# EasyEDA Pro project LCR表.eprj, board #第七届立创电赛#LCR数字电桥
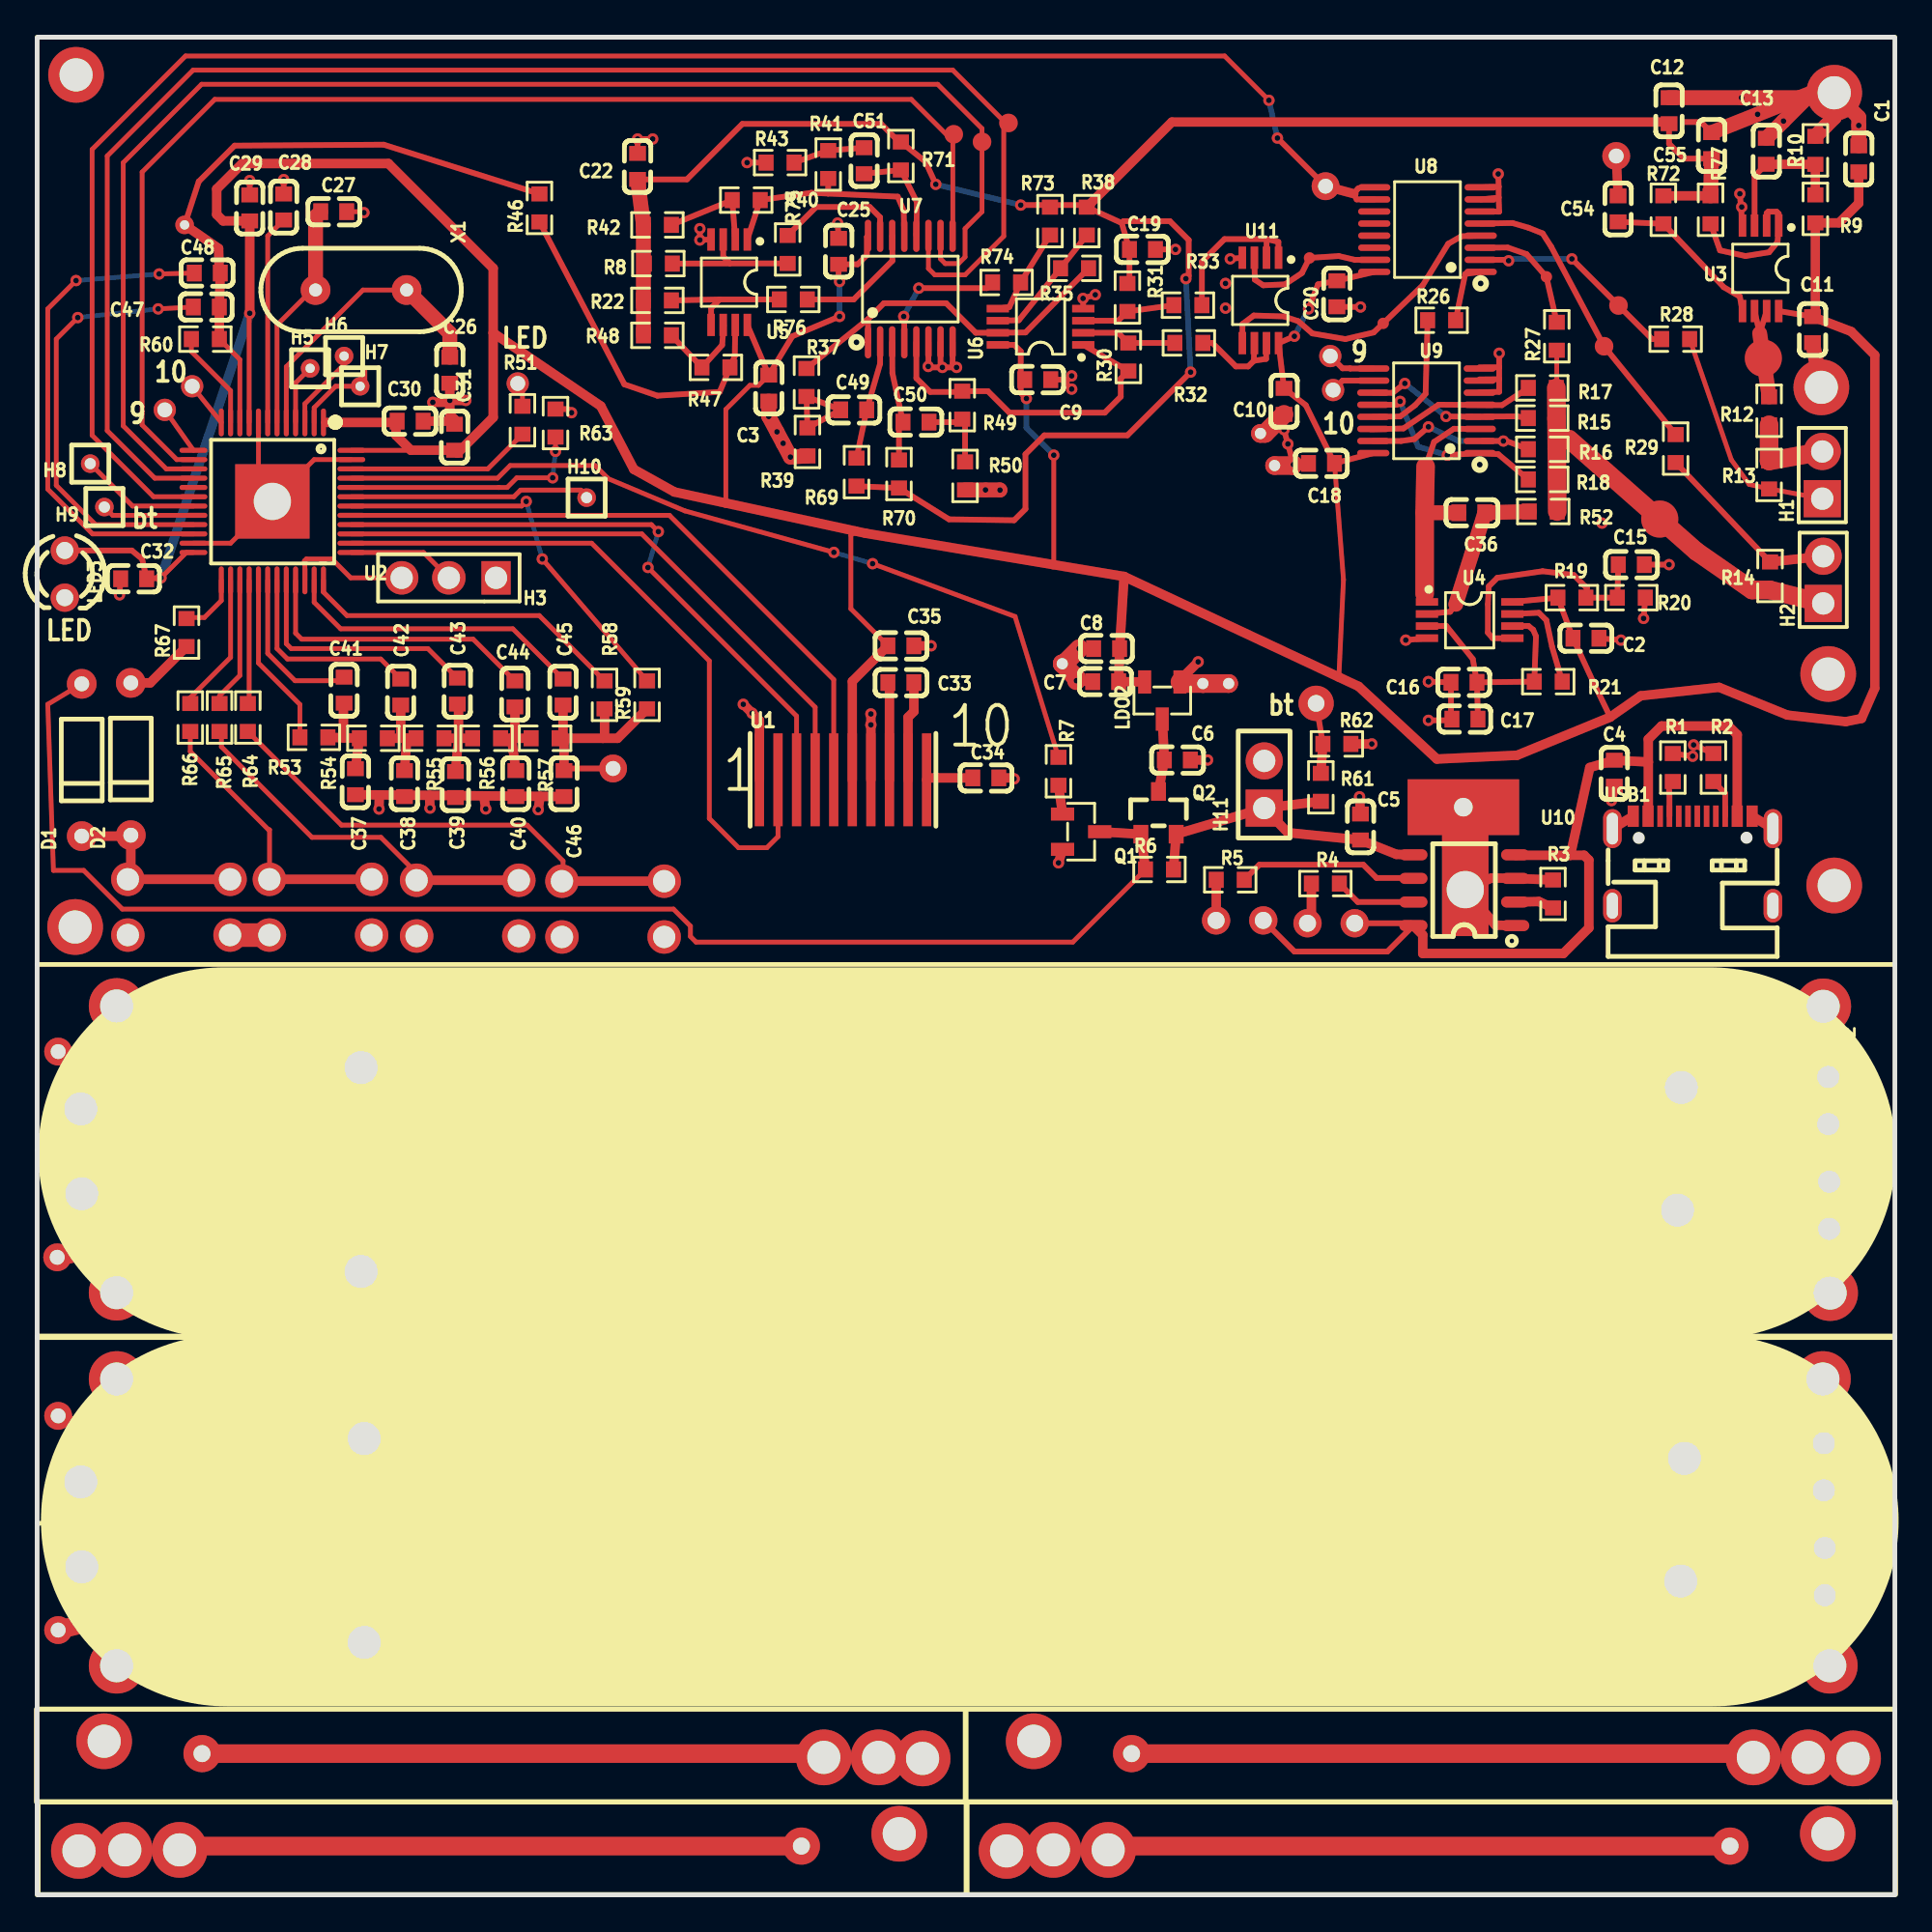
[diagram p1: board, top side]
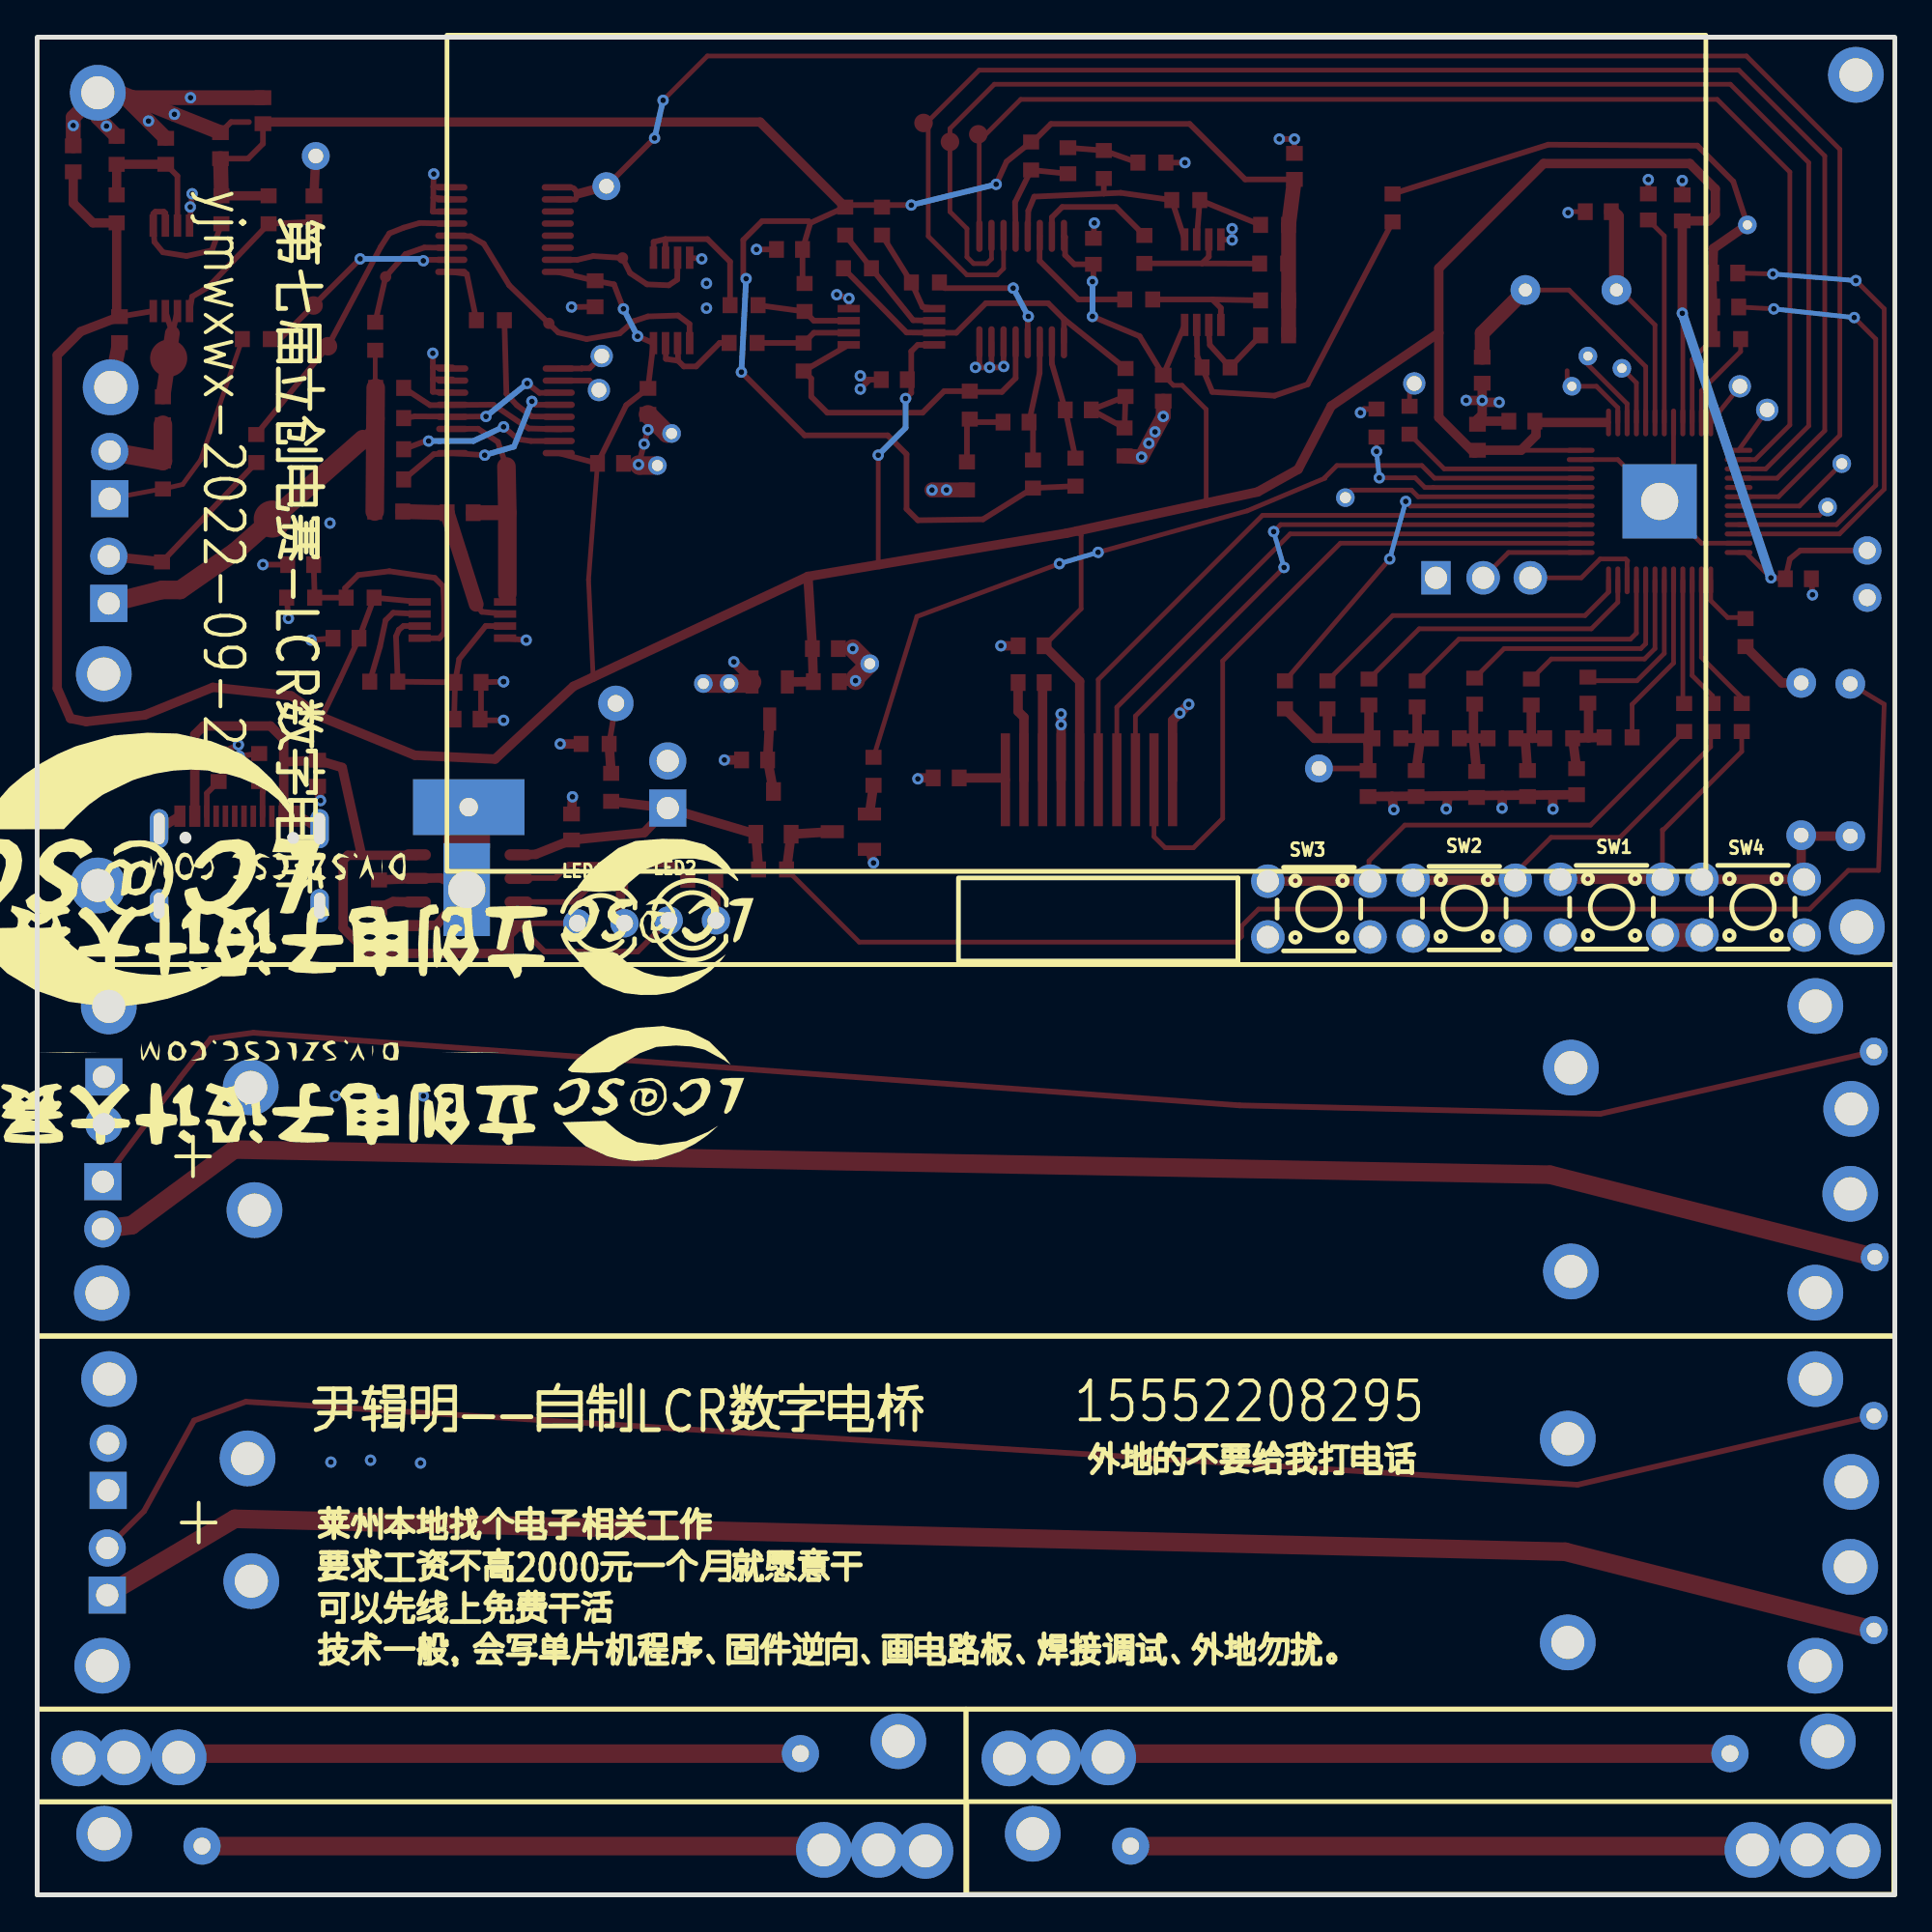
[diagram p2: board, bottom side, seen from below]

Outline 100 x 100 mm; copper layers: Top Layer, Bottom Layer. Coordinates in mm from the lower left corner of the outline.
Outline path: rectangle 0,100 100,0
Stack: Top Layer 0.035mm / Dielectric1 1.51mm FR4 er 4.5 / Bottom Layer 0.035mm

## Design rules (mm)
spacing safeClearance (default): track to track 0.152, other pairs 0.152 to 0.3
track width trackWidth (default): min 0.127, default 0.254, max 2.54
differential pair differentialPair (default): width min 0.127, default 0.254, max 2.54; gap min 0.152, default 0.152
via viaSize (default): diameter min 0.5, default 0.61, max 10; hole min 0.3, default 0.305, max 6
net GND uses copperRegion1

## Placement (name value [footprint] x y rotation side)
C1  100nF  [C0603]  98.06 93.45 90 top
C2  100nF  [C0603]  83.38 67.64 0 top
C3  100nF  [C0603]  39.38 81.11 270 top
C4  10uF  [C0603]  84.9 60.38 90 top
C5  10uF  [C0603]  71.23 57.48 270 top
C6  10uF  [C0603]  61.38 61.09 180 top
C7  100nF  [C0603]  57.52 65.31 0 top
C8  10uF  [C0603]  57.57 67.08 0 top
C9  100nF  [C0603]  53.86 81.56 0 top
C10  100nF  [C0603]  67.12 80.39 270 top
C11  100nF  [C0603]  95.57 84.25 270 top
C12  10uF  [C0603]  87.85 96.04 90 top
C13  10uF  [C0603]  93.08 93.86 270 top
C15  10uF  [C0603]  85.81 71.61 180 top
C16  10uF  [C0603]  76.81 65.27 0 top
C17  100nF  [C0603]  76.86 63.29 0 top
C18  100nF  [C0603]  69.14 77.06 0 top
C19  10uF  [C0603]  59.5 88.57 0 top
C20  100nF  [C0603]  69.96 86.19 90 top
C22  10uF  [C0603]  32.32 93.04 90 top
C25  100nF  [C0603]  43.14 88.47 270 top
C26  22pF  [C0603]  22.21 82.07 90 top
C27  22pF  [C0603]  15.96 90.61 180 top
C28  100nF  [C0603]  13.27 90.86 90 top
C29  10uF  [C0603]  11.44 90.81 90 top
C30  100nF  [C0603]  20.08 79.33 0 top
C31  100nF  [C0603]  22.47 78.46 270 top
C32  100nF  [C0603]  5.19 70.84 0 top
C33  100nF  [C0603]  46.5 65.26 180 top
C34  100nF  [C0603]  51.07 60.12 180 top
C35  100nF  [C0603]  46.5 67.24 180 top
C36  10pF  [C0603]  77.23 74.4 180 top
C37  100pF  [C0603]  17.13 59.92 90 top
C38  100pF  [C0603]  19.77 59.82 90 top
C39  100pF  [C0603]  22.52 59.77 90 top
C40  100pF  [C0603]  25.77 59.82 90 top
C41  10nF  [C0603]  16.52 64.85 90 top
C42  1nF  [C0603]  19.57 64.75 90 top
C43  40nF  [C0603]  22.62 64.8 90 top
C44  200nF  [C0603]  25.72 64.65 90 top
C45  100nF  [C0603]  28.31 64.75 90 top
C46  100pF  [C0603]  28.36 59.82 90 top
C47  100nF  [C0603]  9.11 85.47 0 top
C48  100nF  [C0603]  9.16 87.3 0 top
C49  10uF  [C0603]  43.96 79.94 180 top
C50  10uf  [C0603]  47.31 79.28 0 top
C51  10uF  [C0603]  44.51 93.35 270 top
C54  10uF  [C0603]  85.1 90.76 90 top
C55  100nF  [C0603]  90.13 94.16 270 top
D1  1N4148  [DO-35_BD2.0-L4.2-P8.20-D0.5-RD]  2.4 61.09 90 top
D2  1N4148  [DO-35_BD2.0-L4.2-P8.20-D0.5-RD]  5.04 61.14 90 top
H1  PZ254V-11-02P  [HDR-TH_2P-P2.54-V-M]  96.46 37.12 270 top
H1#2  -  [HDR-TH_2P-P2.54-V-M]  96.09 76.43 90 top
H1#3  -  [HDR-TH_2P-P2.54-V-M]  96.18 23.04 90 top
H2  PZ254V-11-02P  [HDR-TH_2P-P2.54-V-M]  96.41 42.76 270 top
H2#2  -  [HDR-TH_2P-P2.54-V-M]  96.14 70.79 90 top
H2#3  -  [HDR-TH_2P-P2.54-V-M]  96.23 17.4 90 top
H3  2.54-1*3P针  [HDR-TH_3P-P2.54-V-M-1]  22.16 70.89 180 top
H5  -  [HDR-TH_1P-V-M_XKB_X4611WV-01I-C28D40]  14.69 82.17 0 top
H6  -  [HDR-TH_1P-V-M_XKB_X4611WV-01I-C28D40]  16.52 82.83 0 top
H7  -  [HDR-TH_1P-V-M_XKB_X4611WV-01I-C28D40]  17.39 81.21 0 top
H8  -  [HDR-TH_1P-V-M_XKB_X4611WV-01I-C28D40#2]  2.86 77.04 0 top
H9  -  [HDR-TH_1P-V-M_XKB_X4611WV-01I-C28D40#2]  3.62 74.7 0 top
H10  -  [HDR-TH_1P-V-M_XKB_X4611WV-01I-C28D40#2]  29.58 75.21 0 top
H11  18650电池  [HDR-TH_2P-P2.54-V-F]  66.05 59.77 90 top
LDO2  SC662K-3.3V  [SOT-23-3_L2.9-W1.3-P1.90-LS2.4-BR]  60.57 64.29 90 top
LED1  -  [LED-TH_BD3.0-P2.54-FD]  69.65 52.3 180 bottom
LED2  -  [LED-TH_BD3.0-P2.54-FD]  64.73 52.45 180 bottom
LED3  -  [LED-TH_BD3.0-P2.54-FD]  1.49 71.1 270 top
NOREF  -  [Pad_e650]  57.65 2.42 0 top
NOREF#2  -  [Pad_e583]  47.66 7.34 180 top
NOREF#3  -  [Pad_e41]  2.35 42.31 0 top
NOREF#4  -  [Pad_e155]  17.44 44.53 0 top
NOREF#5  -  [Pad_e1124]  84.35 83.36 0 top
NOREF#6  -  [Pad_e1340]  49.34 94.77 0 top
NOREF#7  -  [Pad_e2749]  8.34 81.21 0 top
NOREF#8  -  [Pad_e3]  1.13 14.25 0 top
NOREF#9  -  [Pad_e4475]  66.61 76.94 0 top
NOREF#10  -  [Pad_e189]  88.68 23.49 0 top
NOREF#11  -  [Pad_e2214]  96.52 32.39 180 top
NOREF#12  -  [Pad_e138]  76.87 56.82 180 top
NOREF#13  -  [Pad_e2748]  6.87 79.94 0 top
NOREF#14  -  [Pad_e467]  2.35 22.23 0 top
NOREF#15  -  [Pad_e1118]  85.12 85.56 0 top
NOREF#16  -  [Pad_e159]  88.3 36.86 0 top
NOREF#17  -  [Pad_e42]  2.4 37.74 0 top
NOREF#18  -  [Pad_e1199]  12.66 75.01 0 top
NOREF#19  -  [Pad_e648]  52.18 2.37 0 top
NOREF#20  -  [Pad_e1343]  50.86 94.36 0 top
NOREF#21  -  [Pad_e651]  96.39 3.29 0 top
NOREF#22  -  [Pad_e2223]  96.14 47.83 180 top
NOREF#23  -  [Pad_e1110]  72.46 84.59 0 top
NOREF#24  -  [Pad_e1775]  76.88 54.11 0 top
NOREF#25  -  [Pad_e3514]  7.94 89.89 0 top
NOREF#26  -  [Pad_e190]  88.47 16.89 0 top
NOREF#27  -  [Pad_e585]  42.35 7.4 180 top
NOREF#28  -  [Pad_e187]  17.61 13.59 0 top
NOREF#29  -  [Pad_e211]  96.74 54.33 0 top
NOREF#30  -  [Pad_e4477]  65.85 78.67 0 top
NOREF#31  -  [Pad_e634]  95.33 7.4 180 top
NOREF#32  -  [Pad_e3189]  85 93.6 0 top
NOREF#33  -  [Pad_e2]  1.13 25.78 0 top
NOREF#34  -  [Pad_e748]  68.85 64.14 0 top
NOREF#35  -  [Pad_e2513]  69.76 81 0 top
NOREF#36  -  [Pad_e2233]  96.41 65.72 0 top
NOREF#37  -  [Pad_e598]  2.25 2.37 0 top
NOREF#38  -  [Pad_e652]  91.13 2.62 0 top
NOREF#39  -  [Pad_e43]  4.28 32.42 0 top
NOREF#40  -  [Pad_e584]  45.29 7.4 180 top
NOREF#41  -  [Pad_e487]  96.13 27.77 0 top
NOREF#42  -  [Pad_e205]  96.74 97.01 0 top
NOREF#43  -  [Pad_e2863]  25.87 81.36 0 top
NOREF#44  -  [Pad_e485]  4.28 12.34 0 top
NOREF#45  -  [Pad_e2224]  96.04 81.15 0 top
NOREF#46  -  [Pad_e117]  64.14 65.2 0 top
NOREF#47  -  [Pad_e34]  1.08 34.32 0 top
NOREF#48  -  [Pad_e635]  92.38 7.4 180 top
NOREF#49  -  [Pad_e1332]  52.29 95.38 0 top
NOREF#50  -  [Pad_e33]  1.13 45.39 0 top
NOREF#51  -  [Pad_e1238]  69.35 91.98 0 top
NOREF#52  -  [Pad_e185]  17.61 24.56 0 top
NOREF#53  -  [Pad_e633]  97.75 7.34 180 top
NOREF#54  -  [Pad_e623]  53.64 8.27 180 top
NOREF#55  -  [Pad_e209]  2.05 52.1 0 top
NOREF#56  -  [Pad_e111]  55.18 66.27 0 top
NOREF#57  -  [Pad_e649]  54.71 2.42 0 top
NOREF#58  -  [Pad_e574]  8.87 7.6 180 top
NOREF#59  -  [Pad_e600]  7.67 2.42 0 top
NOREF#60  -  [Pad_e484]  4.28 27.77 0 top
NOREF#61  -  [Pad_e1116]  68.49 88.12 0 top
NOREF#62  -  [Pad_e735]  77.13 72.17 0 top
NOREF#63  -  [Pad_e157]  88.51 43.46 0 top
NOREF#64  -  [Pad_e624]  58.91 7.6 180 top
NOREF#65  -  [Pad_e40]  4.28 47.85 0 top
NOREF#66  -  [Pad_e3196]  31 60.63 0 top
NOREF#67  -  [Pad_e1130]  81.24 87.1 0 top
NOREF#68  -  [Pad_e468]  2.4 17.66 0 top
NOREF#69  -  [Pad_e573]  3.61 8.27 180 top
NOREF#70  -  [Pad_e156]  17.44 33.56 0 top
NOREF#71  -  [Pad_e1369]  92.92 82.72 0 top
NOREF#72  -  [Pad_e207]  2.1 97.97 0 top
NOREF#73  -  [Pad_e486]  96.5 12.34 0 top
NOREF#74  -  [Pad_e136]  76.77 58.55 90 top
NOREF#75  -  [Pad_e114]  62.75 65.2 0 top
NOREF#76  -  [Pad_e599]  4.72 2.42 0 top
NOREF#77  -  [Pad_e602]  41.14 2.62 0 top
NOREF#78  -  [Pad_e601]  46.41 3.29 0 top
NOREF#79  -  [Pad_e1354]  87.34 74.06 0 top
NOREF#80  -  [Pad_e2509]  69.61 82.83 0 top
Q1  AO3400A  [SOT-23-3_L2.9-W1.3-P1.90-LS2.4-BR]  56.2 57.23 180 top
Q2  AO3401A  [SOT-23_L2.9-W1.3-P1.90-LS2.4-BR]  60.36 58.25 270 top
R1  10K  [R0603]  88.05 60.68 90 top
R2  10K  [R0603]  90.23 60.68 270 top
R3  1.3K  [R0603]  81.6 53.88 270 top
R4  1K  [R0603]  69.35 54.44 180 top
R5  1K  [R0603]  64.22 54.64 180 top
R6  10K  [R0603]  60.41 55.2 0 top
R7  10K  [R0603]  54.98 60.48 270 top
R8  10K  [R0603]  33.44 87.81 180 top
R9  10K  [R0603]  95.72 90.76 270 top
R10  10K  [R0603]  95.72 93.91 270 top
R12  200  [R0603]  93.23 79.89 90 top
R13  100  [R0603]  93.23 76.43 90 top
R14  100  [R0603]  93.28 71 90 top
R15  100K  [R0603]  81.02 79.49 0 top
R16  10K  [R0603]  81.02 77.82 0 top
R17  1K  [R0603]  81.02 81.12 0 top
R18  100  [R0603]  81.02 76.19 0 top
R19  10K  [R0603]  82.61 69.83 180 top
R20  10K  [R0603]  85.81 69.83 180 top
R21  10  [R0603]  81.34 65.31 0 top
R22  10K  [R0603]  33.39 85.83 180 top
R26  10K  [R0603]  75.6 84.76 0 top
R27  10K  [R0603]  81.8 83.9 90 top
R28  10K  [R0603]  88.2 83.75 180 top
R29  10K  [R0603]  88.2 77.85 90 top
R30  1K  [R0603]  58.74 82.78 90 top
R31  1K  [R0603]  58.69 85.99 270 top
R32  1K  [R0603]  62 83.54 180 top
R33  1K  [R0603]  61.95 85.57 180 top
R35  6K  [R0603]  55.84 87.56 0 top
R37  900  [R0603]  41.41 81.41 90 top
R38  1K  [R0603]  56.5 90.1 270 top
R39  100  [R0603]  41.47 78.21 90 top
R40  10K  [R0603]  38.17 91.23 0 top
R41  1K  [R0603]  42.58 93.14 270 top
R42  1K  [R0603]  33.39 89.89 0 top
R43  500  [R0603]  39.99 93.25 0 top
R46  100  [R0603]  27.04 90.81 90 top
R47  10K  [R0603]  36.54 82.22 0 top
R48  3.33K  [R0603]  33.39 83.95 0 top
R49  500  [R0603]  49.8 80.19 90 top
R50  100  [R0603]  49.95 76.38 270 top
R51  1K  [R0603]  26.12 79.38 270 top
R52  100  [R0603]  81.07 74.47 180 top
R53  1K  [R0603]  14.9 62.31 0 top
R54  1K  [R0603]  18.1 62.26 0 top
R55  1K  [R0603]  21.15 62.26 0 top
R56  1K  [R0603]  24.19 62.26 0 top
R57  1K  [R0603]  27.34 62.26 0 top
R58  10K  [R0603]  30.54 64.6 90 top
R59  10K  [R0603]  32.83 64.6 90 top
R60  10K  [R0603]  9.06 83.75 180 top
R61  10K  [R0603]  69.1 59.62 90 top
R62  10K  [R0603]  69.96 61.95 0 top
R63  10K  [R0603]  27.9 79.23 270 top
R64  10K  [R0603]  11.34 63.38 90 top
R65  10K  [R0603]  9.82 63.38 90 top
R66  10K  [R0603]  8.24 63.38 90 top
R67  10K  [R0603]  8.04 67.95 90 top
R69  100K  [R0603]  44.11 76.58 90 top
R70  100K  [R0603]  46.39 76.48 90 top
R71  100K  [R0603]  46.5 93.6 90 top
R72  10K  [R0603]  87.54 90.71 270 top
R73  6K  [R0603]  54.52 90.1 90 top
R74  1K  [R0603]  52.18 86.8 0 top
R75  1K  [R0603]  40.4 88.57 270 top
R76  3.33K  [R0603]  40.7 85.88 180 top
R77  10  [R0603]  90.08 90.71 270 top
SW1  TC-1109-C-B  [KEY-TH_4P-L4.5-W4.5-P3.00-LS5.8]  15.25 53.17 180 bottom
SW2  TC-1109-C-B  [KEY-TH_4P-L4.5-W4.5-P3.00-LS5.8]  23.18 53.11 180 bottom
SW3  TC-1109-C-B  [KEY-TH_4P-L4.5-W4.5-P3.00-LS5.8]  31 53.06 180 bottom
SW4  TC-1109-C-B  [KEY-TH_4P-L4.5-W4.5-P3.00-LS5.8]  7.63 53.17 180 bottom
U1  -  [FPC10]  42.38 60.02 0 top
U2  N32G430C8L7  [LQFP-48_L7.0-W7.0-P0.50-LS9.0-BL]  12.66 75.01 180 top
U3  COS722MR  [MSOP-8_L3.0-W3.0-P0.65-LS4.9-BL-1]  92.77 87.56 180 top
U4  COS722MR  [MSOP-8_L3.0-W3.0-P0.65-LS4.9-BL-1]  77.11 68.62 270 top
U5  COS722MR  [MSOP-8_L3.0-W3.0-P0.65-LS4.9-BL-1]  37.25 86.81 180 top
U6  COS722MR  [MSOP-8_L3.0-W3.0-P0.65-LS4.9-BL-1]  54.01 84.41 90 top
U7  RS2253XTSS16  [TSSOP-16_L5.0-W4.4-P0.65-LS6.4-BL]  47 86.44 0 top
U8  RS2253XTSS16  [TSSOP-16_L5.0-W4.4-P0.65-LS6.4-BL]  74.84 89.64 90 top
U9  74HC4052PW,118  [TSSOP-16_L5.0-W4.4-P0.65-LS6.4-BL]  74.79 79.89 90 top
U10  WSP4056  [SOP-8_L5.1-W3.9-P1.27-LS6.0-BL]  76.82 54.08 90 top
U11  COS722MR  [MSOP-8_L3.0-W3.0-P0.65-LS4.9-BL-1]  65.85 85.83 180 top
USB1  TYPEC-304-ACP16  [USB-C-SMD_TYPE-C-16P-1]  89.12 55.66 0 top
X1  8MHz  [OSC-TH_L10.0-W4.5-P5.00]  17.44 86.39 270 top

## Footprints (pads in the part's own frame, mm; a bottom-side part is the same pattern mirrored in y, then rotated)
C0603
  rect 0.8x0.9 smd: 1(-0.7,0) 2(0.7,0)
DO-35_BD2.0-L4.2-P8.20-D0.5-RD
  round 1.6 hole 0.8: 1(-4.099,0) 2(4.099,0)
FPC10
  rect 0.5x5 smd: 1(-3.5,0) 2(-2.5,0) 3(-1.5,0) 4(-0.5,0) 5(0.5,0) 6(1.5,0) 7(2.5,0) 8(3.5,0) 9(4.5,0) 10(5.5,0)
HDR-TH_1P-V-M_XKB_X4611WV-01I-C28D40
  round 1 hole 0.5: 1(0,0)
HDR-TH_1P-V-M_XKB_X4611WV-01I-C28D40#2
  round 1 hole 0.6: 1(0,0)
HDR-TH_2P-P2.54-V-F
  rect 1.999x1.999 hole 1.199: 1(-1.27,0)
  round 1.999 hole 1.199: 2(1.27,0)
HDR-TH_2P-P2.54-V-M
  rect 2x2 hole 1.2: 1(-1.27,0)
  round 2 hole 1.2: 2(1.27,0)
HDR-TH_3P-P2.54-V-M-1
  rect 1.575x1.801 hole 1.199: 1(-2.54,0)
  round 1.801 hole 1.199: 2(0,0) 3(2.54,0)
KEY-TH_4P-L4.5-W4.5-P3.00-LS5.8
  round 1.801 hole 1.199: 1(-2.751,1.501) 2(2.751,1.501) 3(-2.751,-1.501) 4(2.751,-1.501)
LED-TH_BD3.0-P2.54-FD
  round 1.524 hole 0.914: 1(-1.27,0) 2(1.27,0)
LQFP-48_L7.0-W7.0-P0.50-LS9.0-BL
  oval 0.27x1.5 smd: 1(-2.75,-4.25) 2(-2.25,-4.25) 3(-1.75,-4.25) 4(-1.25,-4.25) 5(-0.75,-4.25) 6(-0.25,-4.25) 7(0.25,-4.25) 8(0.75,-4.25) 9(1.25,-4.25) 10(1.75,-4.25) 11(2.25,-4.25) 12(2.75,-4.25) 25(2.75,4.25) 26(2.25,4.25) 27(1.75,4.25) 28(1.25,4.25) 29(0.75,4.25) 30(0.25,4.25) 31(-0.25,4.25) 32(-0.75,4.25) 33(-1.25,4.25) 34(-1.75,4.25) 35(-2.25,4.25) 36(-2.75,4.25)
  oval 1.5x0.27 smd: 13(4.25,-2.75) 14(4.25,-2.25) 15(4.25,-1.75) 16(4.25,-1.25) 17(4.25,-0.75) 18(4.25,-0.25) 19(4.25,0.25) 20(4.25,0.75) 21(4.25,1.25) 22(4.25,1.75) 23(4.25,2.25) 24(4.25,2.75) 37(-4.25,2.75) 38(-4.25,2.25) 39(-4.25,1.75) 40(-4.25,1.25) 41(-4.25,0.75) 42(-4.25,0.25) 43(-4.25,-0.25) 44(-4.25,-0.75) 45(-4.25,-1.25) 46(-4.25,-1.75) 47(-4.25,-2.25) 48(-4.25,-2.75)
MSOP-8_L3.0-W3.0-P0.65-LS4.9-BL-1
  rect 0.406x1.199 smd: 1(-0.976,-2.299) 2(-0.325,-2.299) 3(0.325,-2.299) 4(0.976,-2.299) 5(0.976,2.301) 6(0.325,2.301) 7(-0.325,2.301) 8(-0.976,2.301)
OSC-TH_L10.0-W4.5-P5.00
  round 1.6 hole 0.701: 1(0,2.451) 2(0,-2.451)
Pad_e2
  round 1.5 hole 0.8: 38(0,0)
Pad_e3
  round 1.5 hole 0.8: 40(0,0)
Pad_e33
  round 1.5 hole 0.8: 42(0,0)
Pad_e34
  round 1.5 hole 0.8: 44(0,0)
Pad_e40
  round 3 hole 1.78: 13(0,0)
Pad_e41
  round 3 hole 1.78: 5(0,0)
Pad_e42
  round 3 hole 1.78: 6(0,0)
Pad_e43
  round 3 hole 1.78: 19(0,0)
Pad_e111
  round 1 hole 0.6: 3(0,0)
Pad_e114
  round 1 hole 0.6: 6(0,0)
Pad_e117
  round 1 hole 0.6: 10(0,0)
Pad_e136
  rect 3x6 hole 1: 1(0,0)
Pad_e138
  rect 2.5x1 smd: 6(0,0)
Pad_e155
  round 3 hole 1.78: 15(0,0)
Pad_e156
  round 3 hole 1.78: 26(0,0)
Pad_e157
  round 3 hole 1.78: 27(0,0)
Pad_e159
  round 3 hole 1.78: 40(0,0)
Pad_e185
  round 3 hole 1.78: 30(0,0)
Pad_e187
  round 3 hole 1.78: 41(0,0)
Pad_e189
  round 3 hole 1.78: 42(0,0)
Pad_e190
  round 3 hole 1.78: 55(0,0)
Pad_e205
  round 3 hole 1.78: 52(0,0)
Pad_e207
  round 3 hole 1.78: 70(0,0)
Pad_e209
  round 3 hole 1.78: 89(0,0)
Pad_e211
  round 3 hole 1.78: 109(0,0)
Pad_e467
  round 3 hole 1.78: 1(0,0)
Pad_e468
  round 3 hole 1.78: 2(0,0)
Pad_e484
  round 3 hole 1.78: 9(0,0)
Pad_e485
  round 3 hole 1.78: 15(0,0)
Pad_e486
  round 3 hole 1.78: 22(0,0)
Pad_e487
  round 3 hole 1.78: 30(0,0)
Pad_e573
  round 3 hole 1.78: 25(0,0)
Pad_e574
  round 2 hole 0.914: 38(0,0)
Pad_e583
  round 3 hole 1.78: 24(0,0)
Pad_e584
  round 3 hole 1.78: 25(0,0)
Pad_e585
  round 3 hole 1.78: 29(0,0)
Pad_e598
  round 3 hole 1.78: 45(0,0)
Pad_e599
  round 3 hole 1.78: 46(0,0)
Pad_e600
  round 3 hole 1.78: 50(0,0)
Pad_e601
  round 3 hole 1.78: 46(0,0)
Pad_e602
  round 2 hole 0.914: 59(0,0)
Pad_e623
  round 3 hole 1.78: 27(0,0)
Pad_e624
  round 2 hole 0.914: 40(0,0)
Pad_e633
  round 3 hole 1.78: 26(0,0)
Pad_e634
  round 3 hole 1.78: 27(0,0)
Pad_e635
  round 3 hole 1.78: 31(0,0)
Pad_e648
  round 3 hole 1.78: 47(0,0)
Pad_e649
  round 3 hole 1.78: 48(0,0)
Pad_e650
  round 3 hole 1.78: 52(0,0)
Pad_e651
  round 3 hole 1.78: 48(0,0)
Pad_e652
  round 2 hole 0.914: 61(0,0)
Pad_e735
  round 0.61 smd: TP1(0,0)
Pad_e748
  round 1.9 hole 0.9: 1(0,0)
Pad_e1110
  round 0.61 smd: TP5(0,0)
Pad_e1116
  round 0.61 smd: TP6(0,0)
Pad_e1118
  round 1 smd: TP8(0,0)
Pad_e1124
  round 1 smd: TP9(0,0)
Pad_e1130
  round 0.61 smd: TP10(0,0)
Pad_e1199
  rect 4x4 hole 2: 1(0,0)
Pad_e1238
  round 1.5 hole 0.8: 11(0,0)
Pad_e1332
  round 1 smd: TP1(0,0)
Pad_e1340
  round 1 smd: TP2(0,0)
Pad_e1343
  round 1 smd: TP3(0,0)
Pad_e1354
  round 2 smd: TP6(0,0)
Pad_e1369
  round 2 smd: TP8(0,0)
Pad_e1775
  rect 2.5x5 hole 2: 2(0,0)
Pad_e2214
  round 3 hole 1.78: 34(0,0)
Pad_e2223
  round 3 hole 1.78: 26(0,0)
Pad_e2224
  round 3 hole 1.78: 35(0,0)
Pad_e2233
  round 3 hole 1.78: 27(0,0)
Pad_e2509
  round 1.2 hole 0.8: 1(0,0)
Pad_e2513
  round 1.2 hole 0.8: 2(0,0)
Pad_e2748
  round 1.2 hole 0.8: 3(0,0)
Pad_e2749
  round 1.2 hole 0.8: 5(0,0)
Pad_e2863
  round 1.2 hole 0.8: 3(0,0)
Pad_e3189
  round 1.5 hole 0.8: 3(0,0)
Pad_e3196
  round 1.5 hole 0.8: 6(0,0)
Pad_e3514
  round 1 hole 0.5: 9(0,0)
Pad_e4475
  round 1 hole 0.6: 1(0,0)
Pad_e4477
  round 1 hole 0.6: 13(0,0)
R0603
  rect 0.806x0.864 smd: 1(-0.753,0) 2(0.753,0)
SOP-8_L5.1-W3.9-P1.27-LS6.0-BL
  oval 0.6x1.519 smd: 1(-1.905,-2.74) 2(-0.635,-2.74) 3(0.635,-2.74) 4(1.905,-2.74) 5(1.905,2.74) 6(0.635,2.74) 7(-0.635,2.74) 8(-1.905,2.74)
SOT-23-3_L2.9-W1.3-P1.90-LS2.4-BR
  rect 1.25x0.7 smd: 1(1,-0.95) 2(1,0.95) 3(-1,0)
SOT-23_L2.9-W1.3-P1.90-LS2.4-BR
  rect 1x0.8 smd: 1(1.15,-0.95) 2(1.15,0.95) 3(-1.15,0)
TSSOP-16_L5.0-W4.4-P0.65-LS6.4-BL
  oval 0.343x1.732 smd: 1(-2.276,-2.865) 2(-1.625,-2.865) 3(-0.976,-2.865) 4(-0.325,-2.865) 5(0.325,-2.865) 6(0.976,-2.865) 7(1.625,-2.865) 8(2.276,-2.865) 9(2.276,2.865) 10(1.625,2.865) 11(0.976,2.865) 12(0.325,2.865) 13(-0.325,2.865) 14(-0.976,2.865) 15(-1.625,2.865) 16(-2.276,2.865)
USB-C-SMD_TYPE-C-16P-1
  rect 0.6x1.15 smd: A1B12(-3.2,2.41) A4B9(-2.4,2.41) B1A12(3.2,2.41) B4A9(2.4,2.41)
  rect 0.3x1.15 smd: A5(-1.25,2.41) A6(-0.25,2.41) A7(0.25,2.41) A8(1.25,2.41) B5(1.75,2.41) B6(0.75,2.41) B7(-0.75,2.41) B8(-1.75,2.41)
  oval 1x2.1 hole 0.6x1.7: EP(-4.32,1.74) EP(4.32,1.74)
  oval 1x1.8 hole 0.6x1.4: EP(-4.32,-2.41) EP(4.32,-2.41)

## Nets
As in the schematic, except:
GND: C1.2 C2.2 C3.2 C4.1 C5.1 C6.1 C7.1 C8.1 C9.2 C10.2 C11.2 C12.2 C13.1 C15.1 C16.1 C17.1 C18.1 C19.2 C20.1 C22.2 C25.1 C26.1 C27.1 C28.2 C29.2 C30.2 C31.1 C32.1 C34.1 C35.1 C37.1 C38.1 C39.1 C40.1 C46.1 C55.1 H3.1 H11.2 LDO2.1 NOREF#3.5 NOREF#4.15 NOREF#9.1 NOREF#11.34 NOREF#12.6 NOREF#14.1 NOREF#17.6 NOREF#18.1 NOREF#21.48 NOREF#22.26 NOREF#24.2 NOREF#28.41 NOREF#29.109 NOREF#30.13 NOREF#36.27 NOREF#39.19 NOREF#41.30 NOREF#42.52 NOREF#44.15 NOREF#45.35 NOREF#46.10 NOREF#52.30 NOREF#54.27 NOREF#55.89 NOREF#56.3 NOREF#60.9 NOREF#65.13 NOREF#68.2 NOREF#69.25 NOREF#70.26 NOREF#72.70 NOREF#73.22 NOREF#74.1 NOREF#75.6 NOREF#78.46 Q1.2 R1.2 R2.1 R3.1 R10.1 R20.1 R39.1 R43.1 R50.2 R62.2 R63.1 SW1.3 SW1.4 SW2.3 SW2.4 SW3.3 SW3.4 SW4.3 SW4.4 U1.1 U1.7 U2.8 U2.23 U2.47 U3.4 U4.4 U5.4 U6.4 U7.6 U7.7 U7.8 U8.6 U8.7 U8.8 U9.6 U9.7 U9.8 U10.1 U10.3 U11.4 USB1.A1B12 USB1.B1A12 USB1.EP
+: C5.2 H11.1 NOREF#10.42 NOREF#16.40 NOREF#26.55 NOREF#63.27 Q2.2 R6.2 R61.1 U10.5
BT_DIANYA: H9.1 NOREF#34.1 R61.2 R62.1 U2.20
HC: H1.2 H1#2.2 H1#3.2 NOREF#47.44 R12.1 R13.2
HP: H1.1 H1#2.1 H1#3.1 NOREF#50.42 R13.1 R28.1
LC: H2.1 H2#2.1 H2#3.1 NOREF#8.40 NOREF#79.TP6 R14.1 R15.2 R16.2 R17.2 R18.2 R27.1 R52.1
LP: H2.2 H2#2.2 H2#3.2 NOREF#33.38 R14.2 R29.1
PA0_ADC: C47.2 C48.2 NOREF#25.9 R46.2 R60.1 U2.10
PA2_4052_S0_10: NOREF#7.5 NOREF#35.2 U2.12 U9.10
PA3_4052_S1_9: NOREF#13.3 NOREF#80.1 U2.13 U9.9
PA4_U7_4053_6BEI: NOREF#6.TP2 U2.14 U7.9
PA5_U7_4053_10BEI: NOREF#20.TP3 U2.15 U7.10
PA6_U7_4053_3BEI: NOREF#49.TP1 U2.16 U7.11
PB0_SHANGXIABI: NOREF#51.11 U2.18 U8.9 U8.10
SIN: C45.1 C46.2 C54.2 NOREF#32.3 NOREF#66.6 R57.2 R58.1 R59.1
$1N27792: NOREF#67.TP10 R27.2 U8.3
$1N28504: NOREF#15.TP8 R28.2 U8.2
$1N28894: NOREF#5.TP9 R29.2 U8.5
$1N30170: NOREF#61.TP6 U8.15 U11.3
$1N30303: NOREF#23.TP5 U8.4 U11.5
$1N76678: LED3.2 NOREF#43.3 R51.1
$1N78550: C36.1 NOREF#62.TP1 R52.2 U4.2
$1N223155: NOREF#71.TP8 R12.2 U3.6 U3.7

Pads without a net: NOREF 52; NOREF#2 24; NOREF#19 47; NOREF#27 29; NOREF#31 27; NOREF#37 45; NOREF#38 61; NOREF#40 25; NOREF#48 31; NOREF#53 26; NOREF#57 48; NOREF#58 38; NOREF#59 50; NOREF#64 40; NOREF#76 46; NOREF#77 59; U2 17; U8 11 12 14; USB1 A6 A7 A8 B6 B7 B8

## Via types
v1: diameter 0.61, hole 0.305, Top Layer to Bottom Layer, 114 vias

## Routing (per net, layer and track width the routed paths; a pad name or vN(x,y) marks a point on that pad's centre or on a via; arc(x,y) is an arc through that point)
+1.65V: length 130.9
  Top Layer w0.305: C16.2 R21.1 80.68,67.75 80.53,68.1 80.28,68.3 U4.6 ; C16.2 77.28,66.53 75.86,68.3 74.81,68.3 ; C16.2 C17.2 ; 58.38,90 R38.1 56.39,90.96 v1(52.95,90.96) ; 58.38,90 58.48,90.1 60.97,90.1 61.99,89.08 61.99,87.15 v1(61.84,87) ; 58.38,90 C19.1 58.8,86.85 R31.1 ; C12.1 87.85,94.26 88.65,93.46 C55.2 ; v1(48.37,92.08) 47.82,93.3 R71.2 46.4,94.36 45.43,95.33 37.96,95.33 34.97,92.34 C22.1 ; v1(62.09,81.97) 58.69,78.57 54.22,78.57 53.2,77.55 53.2,74.6 52.59,73.99 49.09,74.04 R70.1 R69.1
  Top Layer w0.5: C12.1 87.76,95.43 61.08,95.43 R38.1 ; R77.1 R72.1
  Top Layer w0.8: R48.1 R22.2 R42.1 C22.1 ; C55.2 R77.1
  Bottom Layer w0.305: v1(48.37,92.08) v1(52.95,90.96) ; v1(62.09,81.97) v1(61.84,87)
+3.3V: length 292.4
  Top Layer w0.254: C18.2 70.32,70.79 70.07,65.55 ; U2.1 15.56,79.26 ; v1(54.72,77.5) 54.72,71.65 54.68,71.61 ; U2.24 8.03,72.26 v1(6.67,70.89) ; C31.2 22.46,77.76 U2.48 ; 44.03,73.41 43.8,73.18 43.8,69.23 C35.2 ; U2.9 11.41,85.11 ; 37.07,74.92 37.07,79.96 38.37,81.26 38.84,81.26 C3.1 ; 11.41,90.08 C29.1
  Top Layer w0.305: LED3.1 5.09,72.37 5.65,71.91 C32.2 v1(6.67,70.89) ; v1(67.68,83.9) 66.82,83.53 C10.1 68.29,80.19 C18.2 U9.16 ; v1(53.25,80.55) 52.95,80.85 52.95,83.09 52.6,83.44 U6.8 ; U8.16 C20.2 68.95,86.69 v1(68.44,85.37) ; 84.68,63.4 83.73,65.36 C2.1 R19.2 U4.8 ; v1(43.19,84.97) 40.65,83.9 C3.1 U5.8 ; 93.75,85.26 C11.1 ; 44.73,89.3 44.67,89.24 44.67,88.27 44.17,87.77 C25.2 43.14,86.9 v1(43.19,86.85)
  Top Layer w0.5: C35.2 43.88,65.32 U1.6 ; 84.68,63.4 86.32,64.55 90.54,65 94.21,63.51 97.36,63.15 98.21,63.33 98.92,64.95 98.92,82.88 97.65,84.15 C11.1 95.72,85.11 R9.2 97,90 98.06,91.06 C1.1
  Top Layer w0.508: 58.51,70.97 70.07,65.55 71.13,65.05 75.35,61.14 79.67,61.34 84.68,63.4 ; 58.51,70.97 C8.2 C7.2 LDO2.2 ; 58.51,70.97 54.68,71.61 44.6,73.29 44.03,73.41 37.07,74.92 34.3,75.52 32.12,76.74 30.34,80.14 24.55,84.08 ; 19.31,79.26 15.56,79.26 ; 19.31,79.26 19.38,79.33 ; 19.31,79.26 19.32,79.25 19.32,78.57 20.12,77.76 C31.2 22.62,77.61 24.55,79.53 24.55,84.08 ; 11.41,85.11 v1(11.44,85.14) C29.1 10.01,90.11 9.67,90.45 9.67,91.82 11.04,93.2 18.91,93.2 24.55,87.56 24.55,84.08
  Bottom Layer w0.305: v1(53.25,80.55) 53.25,78.97 v1(54.72,77.5) ; v1(68.44,85.37) v1(67.68,83.9) ; v1(43.19,86.85) v1(43.19,84.97)
  Bottom Layer w0.508: v1(6.67,70.89) v1(11.44,85.14)
GND: length 155.6
  Top Layer w0.254: v1(17.59,90.55) 17.54,90.61 C27.1 ; U2.47 14.91,77.26 NOREF#18.1 ; NOREF#18.1 10.41,72.76 U2.23 ; NOREF#18.1 11.91,75.76 U2.8
  Top Layer w0.305: v1(48.73,82.22) 48.63,82.33 U7.7 ; v1(48.73,82.22) 48.02,82.22 v1(47.97,82.27) 47.98,82.28 U7.6 ; v1(48.73,82.22) v1(49.49,82.22) 49.28,82.44 49.28,83.57 ; v1(35.67,89.69) v1(35.67,89.08) U5.4 ; v1(28.77,79.78) 28.57,79.98 R63.1 ; C19.2 v1(61.28,88.57) ; v1(74.89,63.22) 76.11,63.22 C16.1 v1(74.89,65.31) ; v1(85.25,67.54) C2.2 ; v1(13.27,92.33) C28.2 ; C20.1 v1(71.23,85.47) ; U8.6 78.7,90.61 78.67,91.36 ; v1(55.69,81.06) 55.18,81.56 ; 55.18,81.56 55.49,81.56 v1(55.69,81.77) ; 55.18,81.56 C9.2 ; v1(89.12,61.29) R1.2 ; 94.86,96.74 95.26,96.74 ; 78.67,91.36 78.67,91.95 ; 78.67,91.36 U8.7 ; 77.64,80.88 78.7,80.91 78.7,81.59 ; 78.7,81.59 78.7,82.23 ; 78.7,81.59 77.64,81.58 ; 78.7,82.23 v1(78.7,82.98) ; 78.7,82.23 77.64,82.23 ; C10.2 v1(67.12,78.87) v1(67.33,78.1) v1(67.63,76.99) C18.1 ; v1(64.22,88.06) U11.4 ; U3.4 v1(91.66,91.57) ; v1(33.13,94.52) v1(32.32,94.52) C22.2 ; R43.1 v1(38.21,93.25) ; 56.31,85.39 v1(56.3,85.94) v1(56.96,86.14) ; U8.8 78.67,91.95 ; 78.67,91.95 v1(78.65,92.64) ; R20.1 v1(86.47,68.71) ; C55.1 89.56,95.43 88.6,95.43 ; C15.1 v1(87.85,71.61) ; v1(89.17,61.9) R2.1 ; v1(4.43,69.98) C32.1 ; v1(11.44,92.28) C29.2 ; C25.1 v1(43.09,90) ; 74.81,67.65 v1(73.67,67.54)
  Top Layer w0.508: 24.04,59.16 27.07,59.13 ; 24.04,59.16 v1(24.15,58.45) ; 24.04,59.16 21.12,59.19 ; 27.07,59.13 C46.1 ; 27.07,59.13 v1(26.97,58.42) ; 18.42,59.21 21.12,59.19 ; 18.42,59.21 C37.1 ; 18.42,59.21 v1(18.4,58.45) ; 21.12,59.19 v1(21.15,58.5) ; C26.1 v1(22.21,80.44) ; v1(22.21,80.44) v1(23.08,80.44) ; v1(22.21,80.44) 22.11,80.34 v1(21.3,80.34) ; v1(22.21,80.44) 22.21,79.68 22.47,79.43 C31.1 22.3,79.33 C30.2 ; U1.1 38.88,63.22 v1(38.49,63.61) v1(38.01,64.09) ; v1(71.84,61.95) R62.2 ; USB1.EP USB1.A1B12 ; C4.1 v1(84.75,58.91) ; v1(56.1,67.08) C8.1 ; v1(63,61.09) 62.08,61.09 ; U10.1 78.5,52.2 NOREF#24.2 78.3,54.74 U10.3 R3.1 ; v1(62.5,66.37) 61.52,65.39 LDO2.1 ; v1(48.12,67.24) C35.1 ; USB1.EP USB1.B1A12 ; v1(71.18,59.11) C5.1 ; 44.87,63.58 v1(44.88,63.57) v1(44.88,62.98) U1.7 ; Q1.2 v1(54.98,55.55) ; C34.1 52.54,60.12 v1(52.59,60.07) ; v1(55.94,65.36) C7.1
  Top Layer w0.8: R50.2 v1(51.05,75.63) 51.82,75.63 v1(51.83,75.62) ; C55.1 v1(92.61,95.85) 94.86,96.74 ; R39.1 v1(40.55,77.4) v1(40.16,78.14) v1(39.83,78.75) v1(39.38,79.58) C3.2 ; 95.57,83.56 NOREF#45.35 ; C1.2 v1(98.06,95.24) 98.06,95.69 NOREF#42.52 ; NOREF#42.52 95.53,97.01 ; NOREF#42.52 96.74,95.68 v1(96.27,95.21) R10.1 ; 94.86,96.74 95.53,97.01 ; 94.86,96.74 v1(91.75,96.74) C12.2 ; 95.53,97.01 v1(94.01,95.48) C13.1
  Top Layer w1: v1(67.63,76.99) 67.58,76.94 NOREF#9.1 ; LDO2.1 61.6,65.2 NOREF#75.6 NOREF#46.10 ; v1(55.94,65.36) 55.94,65.51 NOREF#56.3 55.28,66.27 v1(56.1,67.08) ; NOREF#30.13 66.09,78.67 C10.2
  Top Layer w1.27: SW4.3 SW1.4
  vias: v1(63.97,86.74) v1(63.97,85.41) v1(79.21,43.01) v1(79.36,23.24) v1(81.85,42.9) v1(82.06,23.4) v1(83.93,43.01) v1(84.24,73.84) v1(84.19,23.29) v1(91.76,90.86)
VCC: length 53.4
  Top Layer w0.305: LED2.1 67.68,50.78 72.68,50.78 U10.8 73.95,52.3 LED1.1
  Top Layer w0.508: 86.73,60.98 C4.2 83.58,60.68 82.53,55.96 ; 86.73,60.98 86.73,62.21 87.44,62.92 91.05,62.92 91.52,62.45 USB1.B4A9 ; 86.73,60.98 86.73,58.08 USB1.A4B9 ; U10.4 79.59,55.96 82.53,55.96 ; 82.53,55.96 83.27,55.96 83.53,55.71 83.53,52.05 82.16,50.68 74.59,50.68 74.59,51.67 U10.8
(no net): length 151.7
  Top Layer w0.254: NOREF#59.50 NOREF#76.46 1.82,2.42 ; 51.81,2.42 NOREF#57.48 NOREF.52 ; NOREF#31.27 98.23,7.4 ; NOREF#40.25 48.19,7.4
  Top Layer w1: NOREF#64.40 92.18,7.6 NOREF#48.31 ; NOREF.52 57.86,2.62 NOREF#38.61 ; NOREF#27.29 42.14,7.6 NOREF#58.38 ; NOREF#59.50 7.87,2.62 NOREF#77.59
+: length 18.7
  Top Layer w0.508: R6.2 Q2.2 H11.1 ; H11.1 R61.1 ; H11.1 67.32,57.18 C5.2 73.16,56.01 U10.5
BT_DIANYA: length 8.8
  Top Layer w0.254: U2.20 4.06,74.26 H9.1
  Top Layer w0.305: 69.21,61.95 NOREF#34.1
  Top Layer w0.508: R61.2 69.21,61.95
HC: length 102.2
  Top Layer w1: H1.2 94.91,36.05 89.4,40.12 18.56,38.77 NOREF#47.44 ; R12.1 R13.2 H1#2.2
HP: length 112.5
  Top Layer w0.254: 92.98,75.74 R13.1 ; 92.98,75.74 92.16,75.92 91.2,77.25 R28.1 ; 92.98,75.74 H1#2.1
  Top Layer w0.305: H1.1 92.32,43.97 90.64,46.1 88.35,46.41 35.27,42.5 15.86,42.04 NOREF#50.42
LC: length 124.5
  Top Layer w0.254: R27.1 81.8,81.14 R17.2
  Top Layer w0.305: 81.8,77.82 R16.2 81.8,77.84 82.46,78.36 81.79,79.47 R15.2 ; 92.31,70.24 92.27,70.28
  Top Layer w1: R17.2 81.79,79.47 81.8,77.84 81.8,77.82 R52.1 ; 96.14,69.52 R14.1 92.31,70.24 89.32,72.32 NOREF#79.TP6 82.46,78.36 ; H2#3.1 96.22,16.18 89.36,20.24 17.75,18.47 NOREF#8.40
LP: length 109.8
  Top Layer w0.305: R14.2 R29.1 ; H2#3.2 94.25,20.65 91.55,25.53 88.76,26.55 17.08,22.08 NOREF#33.38
  Top Layer w0.508: R14.2 H2#2.2
PA0_ADC: length 34.2
  Top Layer w0.254: R60.1 10.91,82.64 U2.10
  Top Layer w0.305: NOREF#25.9 8.7,92.23 10.63,94.16 18.66,94.21 R46.2
  Top Layer w0.508: C48.2 9.81,85.57 ; NOREF#25.9 9.77,88.62 9.81,87.09 ; C47.2 R60.1
PA2_4052_S0_10: length 4.9
  Top Layer w0.254: U2.12 NOREF#7.5
  Top Layer w0.305: U9.10 70.27,81.51 NOREF#35.2
PA3_4052_S1_9: length 5.3
  Top Layer w0.254: U2.13 NOREF#13.3
  Top Layer w0.305: U9.9 70.69,82.16 70.68,82.17 70.27,82.17 NOREF#80.1
PA4_U7_4053_6BEI: length 68.4
  Top Layer w0.254: U2.14 7.52,77.26 5.65,79.12 5.65,92.74 9.56,96.65 47.05,96.65 49.29,94.42 49.29,89.31 49.28,89.3
PA5_U7_4053_10BEI: length 78
  Top Layer w0.254: U7.10 48.63,88.06 48.88,87.81 49.59,87.81 49.95,88.17 49.95,89.69 50.86,90.61 NOREF#20.TP3 50.86,95.08 48.48,97.46 8.85,97.46 4.64,93.25 4.64,79.07 6.95,76.76 U2.15
PA6_U7_4053_3BEI: length 84.8
  Top Layer w0.254: U7.11 47.98,87.55 48.32,87.2 49.95,87.2 52.03,89.28 52.03,95.48 49.29,98.22 8.39,98.22 3.77,93.6 3.77,78.82 6.33,76.26 U2.16
PA13_SWDIO: length 6.8
  Top Layer w0.254: U2.34 14.41,71.79 14.39,71.81 14.49,71.91 15.86,71.91 16.88,70.89 H3.3
PA14_SWCLK: length 5.8
  Top Layer w0.254: U2.37 20.8,72.26 H3.2
PA15_RST: length 38
  Top Layer w0.254: U2.38 29.85,72.76 36.18,66.42 36.18,57.94 37.76,56.37 39.28,56.37 39.88,56.97 U1.2
PB0_SHANGXIABI: length 97.6
  Top Layer w0.254: U2.18 8.41,75.26 6.26,75.26 2.96,78.57 2.96,93.96 7.99,98.99 63.92,98.99 v1(66.31,96.6)
  Top Layer w0.305: U8.10 71.03,91.27 70.88,91.57 71.08,91.82 71.13,91.88 ; NOREF#51.11 v1(66.76,94.57)
  Top Layer w0.5: NOREF#51.11 70.88,91.57
  Bottom Layer w0.305: v1(66.76,94.57) v1(66.31,96.6)
PB3_SPI1_SCK: length 32.7
  Top Layer w0.254: U2.39 32.55,73.26 41.88,63.93 U1.4
PB4_RS: length 33.4
  Top Layer w0.254: U1.3 40.88,63.45 v1(32.88,71.45) ; U2.40 33.06,73.76 v1(33.44,73.38)
  Bottom Layer w0.254: v1(32.88,71.45) v1(33.44,73.38)
PB5_SPI1_MOSI: length 35
  Top Layer w0.254: U2.41 34.04,74.26 42.88,65.42 U1.5
PB8_GUANJI: length 45.5
  Top Layer w0.254: v1(42.89,72.27) 34.86,74.5 30.68,76.26 30.7,76.28 30.04,76.94 25.46,76.94 24.78,76.26 U2.45 ; v1(44.97,71.66) 52.64,68.81 R7.1
  Bottom Layer w0.254: v1(44.97,71.66) v1(42.89,72.27)
PB9_LCD_BEIGUANG: length 10
  Top Layer w0.254: U2.46 24.26,76.76 R51.2
PB12_KAIJI: length 3.8
  Top Layer w0.508: D2.2 6.08,65.24 R67.1
SIN: length 15.6
  Top Layer w0.305: C46.2 28.47,60.63 NOREF#66.6
  Top Layer w0.5: NOREF#32.3 C54.2
  Top Layer w0.508: R57.2 28.31,62.47 C45.1 ; R57.2 30.46,62.26 ; R57.2 28.36,62 C46.2 ; 30.46,62.26 30.54,62.35 R58.1 ; 30.46,62.26 31.25,62.26 R59.1
$1N5478: length 2
  Top Layer w0.305: R1.1 87.85,59.73 87.85,59.36 87.87,59.34 USB1.A5
$1N5501: length 2.1
  Top Layer w0.305: USB1.B5 90.87,59.3 R2.2
$1N5982: length 2.1
  Top Layer w0.508: U10.2 80.84,53.47 R3.2
$1N6392: length 2.2
  Top Layer w0.508: 68.38,52.3 68.59,52.51 R4.2
$1N6468: length 2.2
  Top Layer w0.508: LED2.2 63.47,52.46 R5.2
$1N6485: length 4.4
  Top Layer w0.305: U10.7 71.09,53.44 R4.1
$1N7176: length 9.7
  Top Layer w0.305: R5.1 65.79,55.45 71.39,55.45 72.1,54.74 74.06,54.74 U10.6
$1N9457: length 3.9
  Top Layer w0.508: Q2.3 C6.2 LDO2.3
$1N9972: length 77.5
  Top Layer w0.254: D1.2 0.57,64.09 0.88,55.15 2.5,55.15 4.58,53.06 34.25,53.06 35.17,52.15 35.17,51.59 35.47,51.29 55.75,51.29 R6.1
  Top Layer w0.508: R6.1 Q2.1 Q1.3
$1N10161: length 1.6
  Top Layer w0.508: Q1.1 R7.2
$1N19892: length 10
  Top Layer w0.305: U9.15 73.42,78.26 74.13,78.36 v1(74.89,79.02) ; 77.79,78.27 79.11,78.26 R16.1
  Bottom Layer w0.305: v1(78.93,78.26) 76.52,78.26 v1(74.89,79.02)
$1N19979: length 9.2
  Top Layer w0.305: 71.78,78.89 73.55,78.94 75.44,80.22 78.85,80.19 R17.1
$1N20068: length 10.6
  Top Layer w0.305: v1(75.91,77.5) U9.1 78.65,77.55 R18.1 ; v1(73.37,80.39) 73.19,80.21 U9.12
  Bottom Layer w0.305: v1(75.91,77.5) 74.33,77.96 v1(73.37,80.39)
$1N20282: length 8.7
  Top Layer w0.305: R15.1 79.67,79.58 77.95,79.58 ; v1(73.62,81.36) 72.96,80.85 U9.11 ; U9.4 76.01,79.58
  Bottom Layer w0.305: v1(73.62,81.36) v1(75.84,79.58)
$1N24127: length 13.7
  Top Layer w0.305: U4.5 78.35,67.64 78.09,67.95 78.09,69.47 78.14,70.44 78.6,70.89 81.04,71.25 82.72,71.05 83.43,70.34 R19.1 R20.2 C15.2
$1N24240: length 5.4
  Top Layer w0.305: U4.7 80.84,69.02 81.24,68.61 81.55,67.19 R21.2
$1N26891: length 7.2
  Top Layer w0.305: U9.13 73.37,79.58 74.18,80.19 74.74,80.8 R26.1
$1N27670: length 3.4
  Top Layer w0.305: U8.1 76.87,87.25 R26.2
$1N27792: length 6.7
  Top Layer w0.305: U8.3 79.16,88.67 80.18,88.32 NOREF#67.TP10 R27.2
$1N28504: length 11.6
  Top Layer w0.305: R28.2 86.93,83.75 NOREF#15.TP8 v1(82.61,88.06) ; U8.2 79.16,88.01 v1(79.21,87.96)
  Bottom Layer w0.305: v1(79.21,87.96) 79.31,88.06 v1(82.61,88.06)
$1N28894: length 16.5
  Top Layer w0.305: U8.5 79.41,90 80.28,89.74 81.04,89.44 81.5,88.73 NOREF#5.TP9 R29.2
$1N30170: length 8.4
  Top Layer w0.305: U8.15 70.93,88.01 70.07,88.22 NOREF#61.TP6 68.09,87.3 67.17,86.69 66,86.64 65.54,86.95 U11.3
$1N30303: length 16.7
  Top Layer w0.305: U8.4 76.67,89.28 75.96,88.88 74.59,86.64 NOREF#23.TP5 71.95,84.1 70.42,83.75 68.64,84.05 67.88,84.71 67.12,84.97 65.49,85.02 64.88,84.56 U11.5
$1N31719: length 5.1
  Top Layer w0.305: 61.19,85.57 R31.2 58.19,84.74 56.31,84.74
$1N32954: length 5.2
  Top Layer w0.305: 56.31,84.09 58.19,84.09 R30.2 58.74,83.54 R32.2
$1N33172: length 5.9
  Top Layer w0.305: U11.7 66.15,82.68 65.49,82.58 ; 65.49,82.58 U11.6 ; 65.49,82.58 65.19,82.27 64.53,82.27 63.26,83.54 R32.1
$1N33324: length 8.8
  Top Layer w0.305: U11.2 66.18,89.13 ; 66.18,89.13 66.81,88.98 66.82,88.13 ; 66.18,89.13 63.92,89.13 62.7,87.91 R33.1
$1N39125: length 5.1
  Top Layer w0.305: U6.5 52.34,85.47 R74.2 R73.1
$1N40913: length 5.7
  Top Layer w0.305: U5.2 R40.1 R42.2
$1N42299: length 7.6
  Top Layer w0.305: R75.2 37.29,87.82 ; 37.29,87.82 36.93,88.18 U5.3 ; 37.29,87.82 R8.1
$1N44948: length 7.4
  Top Layer w0.305: R22.1 36.74,85.88 ; 36.74,85.88 36.28,85.42 U5.5 ; 36.74,85.88 R76.2
$1N45128: length 18.9
  Top Layer w0.305: 27.04,90.06 31.61,81.31 33.39,80.7 36.74,80.9 R47.2 37.55,82.83 U5.7
$1N45678: length 5.1
  Top Layer w0.305: U5.6 36.95,84.48 36.87,83.42 R47.1 R48.2
$1N49359: length 19.8
  Top Layer w0.305: R35.2 53.2,84.1 U6.7 50.52,84.09 48.93,85.68 45.58,85.68 44.73,84.82 ; 44.73,84.82 44.73,83.57 ; 44.73,84.82 R37.2
$1N49560: length 6.8
  Top Layer w0.305: R75.1 41.93,90.86 44.82,90.86 45.38,90.3 45.38,89.3
$1N49953: length 12.7
  Top Layer w0.305: R41.2 42.58,91.58 ; 42.58,91.58 41.67,91.62 R40.2 U5.1 ; 42.58,91.58 46.33,91.42 46.65,90.66 U7.13
$1N50153: length 6.8
  Top Layer w0.305: R76.1 43.96,85.88 46.04,87.96 46.04,89.29 U7.14
$1N55108: length 15.8
  Top Layer w0.254: U2.5 13.41,82.26 17.54,86.39 X1.1
  Top Layer w0.8: C26.2 22.21,84.06 X1.1
$1N55316: length 12.4
  Top Layer w0.254: U2.6 12.91,84.5 14.8,86.39 X1.2
  Top Layer w0.8: X1.2 14.99,90.33 C27.2
$1N56684: length 11.3
  Top Layer w0.254: U2.7 12.41,89.3 13.27,90.16
$1N65263: length 5.3
  Top Layer w0.508: U1.8 45.88,65.17 C33.2
$1N65484: length 5.4
  Top Layer w0.508: U1.9 46.88,63.39 47.19,63.7 C33.1
$1N65778: length 2.5
  Top Layer w0.508: U1.10 47.98,60.12 C34.2
$1N76678: length 1.3
  Top Layer w0.254: NOREF#43.3 26.12,81.11 R51.1
$1N78550: length 9.3
  Top Layer w0.305: 74.81,68.95 76.06,69.07 76.37,69.47
  Top Layer w0.8: R52.2 C36.1 76.37,69.47
$1N78784: length 13.3
  Top Layer w0.305: 74.74,76.89 75.2,78.21 76.26,78.92 U9.3 ; 74.69,70.03 74.81,69.91 74.81,69.6
  Top Layer w0.8: 76.53,74.4 74.69,74.4
  Top Layer w1: 74.69,70.03 74.69,74.4 74.74,76.89
$1N79731: length 9.4
  Top Layer w0.254: R53.1 14.14,64.08 11.91,66.31 U2.29
$1N83028: length 5.1
  Top Layer w0.508: 19.51,62.26 19.57,62.32 C42.1 ; 19.51,62.26 R54.2 ; 19.51,62.26 19.9,62.26 ; 19.9,62.26 C38.2 ; 19.9,62.26 R55.1
$1N83269: length 5.2
  Top Layer w0.508: 22.68,62.26 R56.1 ; 22.68,62.26 R55.2 ; 22.68,62.26 22.68,64.03 C43.1 ; 22.68,62.26 C39.2
$1N83512: length 5.2
  Top Layer w0.508: C44.1 25.72,62.44 25.54,62.26 ; C40.2 25.54,62.26 ; 25.54,62.26 R56.2 ; 25.54,62.26 R57.1
$1N86336: length 8.7
  Top Layer w0.254: C41.2 16.33,65.36 13.88,65.36 12.41,66.83 U2.30
$1N86592: length 11
  Top Layer w0.254: U2.31 12.91,67.09 13.47,66.53 18.49,66.53 C42.2
$1N86848: length 13.4
  Top Layer w0.254: C43.2 21.03,67.08 13.68,67.08 13.41,67.35 U2.32
$1N87104: length 15.7
  Top Layer w0.254: C44.2 23.47,67.59 14.24,67.59 13.91,67.92 U2.33
$1N87360: length 16.3
  Top Layer w0.254: C45.2 25.61,68.15 16.34,68.15 14.91,69.58 U2.35
$1N88068: length 17.7
  Top Layer w0.254: R58.2 27.03,68.86 16.67,68.86 15.41,70.13 U2.36
$1N90333: length 21.4
  Top Layer w0.254: U2.42 26.08,74.76 v1(26.33,75.01) ; R59.2 v1(27.19,71.91)
  Bottom Layer w0.254: v1(27.19,71.91) v1(26.33,75.01)
$1N94084: length 5.4
  Top Layer w0.254: R60.2 8.3,83.08 10.41,80.97 U2.11
$1N95256: length 27.1
  Top Layer w0.254: U2.22 2.98,73.26 0.57,75.67 0.57,85.37 v1(2.1,86.9) ; v1(6.57,87.25) C48.1
  Bottom Layer w0.254: v1(2.1,86.9) v1(6.57,87.25)
$1N95522: length 24.2
  Top Layer w0.254: v1(6.52,85.37) C47.1 ; 2.3,85.02 1.03,83.75 1.03,75.87 3.14,73.76 U2.21
  Bottom Layer w0.254: v1(2.19,84.91) v1(6.52,85.37)
$1N104798: length 13.3
  Top Layer w0.254: 24.84,75.76 25.3,75.76 25.82,76.28 v1(27.75,76.28) ; 24.84,75.76 24.85,75.77 ; 24.84,75.76 U2.44 ; v1(27.9,77.7) R63.2
  Bottom Layer w0.254: v1(27.75,76.28) v1(27.9,77.7)
$1N112001: length 3.4
  Top Layer w0.254: U2.25 9.91,69.67 9,68.76 8.1,68.76 R67.2
$1N112276: length 7.5
  Top Layer w0.254: R66.2 8.24,64.44 10.41,66.61 U2.26
$1N112550: length 7.1
  Top Layer w0.254: U2.27 10.91,65.64 9.82,64.55 R65.2
$1N112826: length 6.7
  Top Layer w0.254: R64.2 11.41,64.2 U2.28
$1N130277: length 3.2
  Top Layer w0.254: H5.1 13.91,81.39 U2.4
$1N130572: length 5.5
  Top Layer w0.254: 17.64,82.05 17.64,81.11 17.54,81 ; U2.3 14.41,80.27 16.52,82.38 H6.1
$1N130867: length 3.5
  Top Layer w0.254: 17.19,81.21 16.07,81.21 14.91,80.05 U2.2
$1N131552: length 6.5
  Top Layer w0.254: U2.19 5.14,74.76 H8.1
$1N132476: length 12.9
  Top Layer w0.254: U2.43 25.66,75.26 26.02,75.62 29.27,75.62 29.58,75.31
$1N150454: length 10.6
  Top Layer w0.508: D1.1 4.99,56.99 D2.1 5.04,54.83 SW4.2 SW4.1
$1N155250: length 15.3
  Top Layer w0.254: 8.24,62.62 8.24,61.55 12.46,57.33 12.51,57.33 12.51,54.67 SW1.2
  Top Layer w0.508: SW1.2 SW1.1
$1N156292: length 20.1
  Top Layer w0.254: 9.82,62.62 9.92,62.52 9.92,61.8 14.8,56.92 18.5,56.92 20.43,55 20.43,54.62
  Top Layer w0.508: 20.43,54.62 SW2.1
$1N157433: length 26.5
  Top Layer w0.254: SW3.2 28.31,54.62 28.31,55.66 26.38,57.58 16.38,57.58 11.34,62.62
  Top Layer w0.508: SW3.2 SW3.1
$1N176679: length 5.2
  Top Layer w0.508: 16.49,62.28 R54.1 C37.2 ; 16.49,62.28 16.49,64.11 C41.1 ; 16.49,62.28 R53.2
$1N182949: length 6.4
  Top Layer w0.305: R69.2 C49.1 45.38,82.43 45.38,83.57
$1N183233: length 5.7
  Top Layer w0.305: R39.2 C49.2 R37.1 R39.2
$1N191358: length 3.9
  Top Layer w0.305: C51.1 R41.1 R43.2
$1N191653: length 5.7
  Top Layer w0.305: C51.2 R71.1 47.36,91.11 U7.12
$1N202848: length 7.2
  Top Layer w0.305: v1(47.46,86.49) 51.13,86.49 R74.1 ; v1(46.65,84.97) 46.68,84.94 U7.4
  Bottom Layer w0.305: v1(46.65,84.97) v1(47.46,86.49)
$1N203128: length 7
  Top Layer w0.305: U6.6 52.84,84.76 R35.1 R38.2
$1N211469: length 4.2
  Top Layer w0.305: R50.1 49.95,79.29 R49.1 49.64,79.28 C50.2
$1N212873: length 18.4
  Top Layer w0.305: U7.5 47.33,81.64 48.07,80.9 49.75,80.9 R49.2 51.18,80.94 52.34,79.78 57.47,79.78 58.33,80.65 58.33,81.62 R30.1 56.31,83.44
$1N213170: length 6.5
  Top Layer w0.305: R70.2 46.39,79.06 C50.1 46.04,81.92 U7.3
$1N223155: length 5.9
  Top Layer w0.305: U3.7 92.72,84.05 U3.6
  Top Layer w0.8: R12.2 NOREF#71.TP8 92.72,84.05
$1N225349: length 8.9
  Top Layer w0.305: C54.1 R72.2 90.79,86.54 91.66,86.03 U3.5
$1N235974: length 7.8
  Top Layer w0.305: U3.3 92.45,92.53 C13.2
  Top Layer w0.5: C13.2 95.72,93.16 R10.2 R9.1
$1N236262: length 7.8
  Top Layer w0.305: R77.2 90.59,88.52 91.96,88.22 93.23,88.42 93.69,88.98 93.75,89.86 93.75,90.49 93.64,90.61 93.18,90.61 93.1,90.52 U3.2

## Copper pours and planes (outline as drawn; the poured copper is in the pictures)
GND on Top Layer: 0,50.08 100.04,50.08 100.04,0.02 0,0.02
GND on Bottom Layer: 0.76,100.81 100.76,100.81 100.76,0.81 0.76,0.81

## Text on the board
Bottom Silkscreen Layer: 15552208295 | yjmwxwx-2022-09-20 | + | 外地的不要给我打电话 | 莱州本地找个电子相关工作 / 要求工资不高2000元一个月就愿意干 / 可以先线上免费干活 / 技术一般，会写单片机程序、固件逆向、画电路板、焊接调试、外地勿扰。 | 尹辑明——自制LCR数字电桥 | 第七届立创电赛-LCR数字电桥
Top Silkscreen Layer: LED | 9 | bt | 10 | 1
